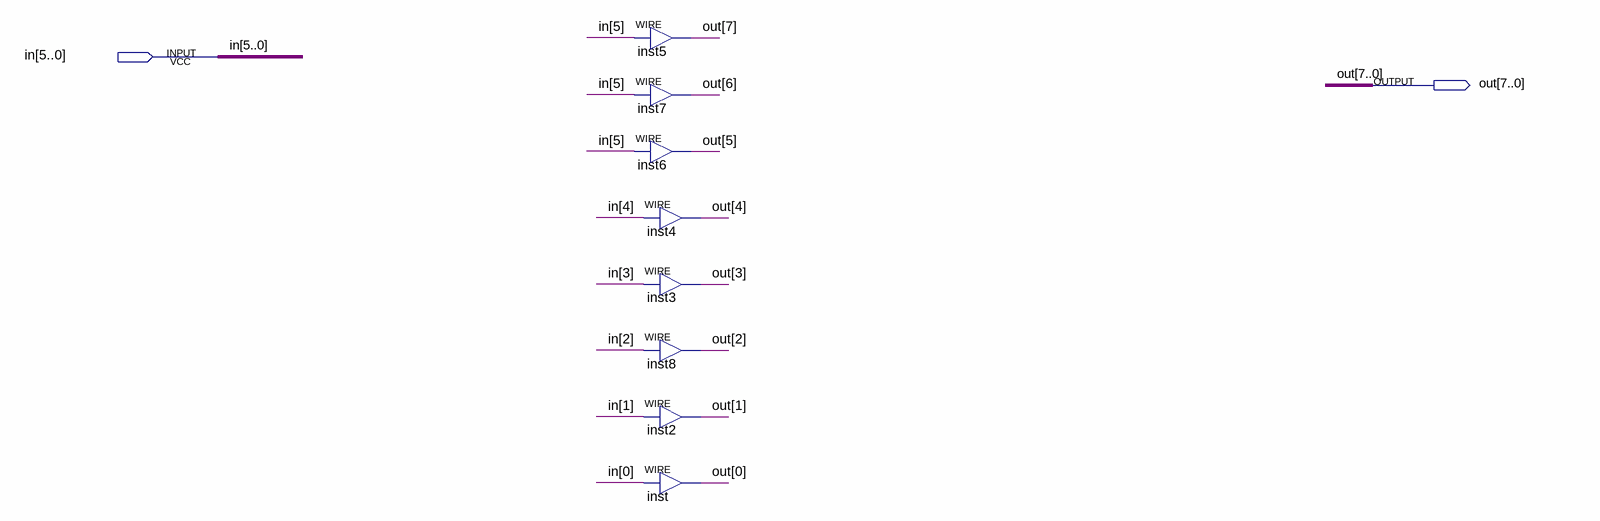
[diagram p0: schematic sheet]
// Quartus schematic signExtend.bdf as structural Verilog: 8 symbols, 2 pins
module signExtend (
  input  [5:0] in,
  output [7:0] out
);

  assign out[7] = in[5];  // WIRE inst5
  assign out[6] = in[5];  // WIRE inst7
  assign out[5] = in[5];  // WIRE inst6
  assign out[4] = in[4];  // WIRE inst4
  assign out[3] = in[3];  // WIRE inst3
  assign out[2] = in[2];  // WIRE inst8
  assign out[1] = in[1];  // WIRE inst2
  assign out[0] = in[0];  // WIRE inst
endmodule
